# EAGLE design PiCycle PCB (EAGLE 8.7.0)
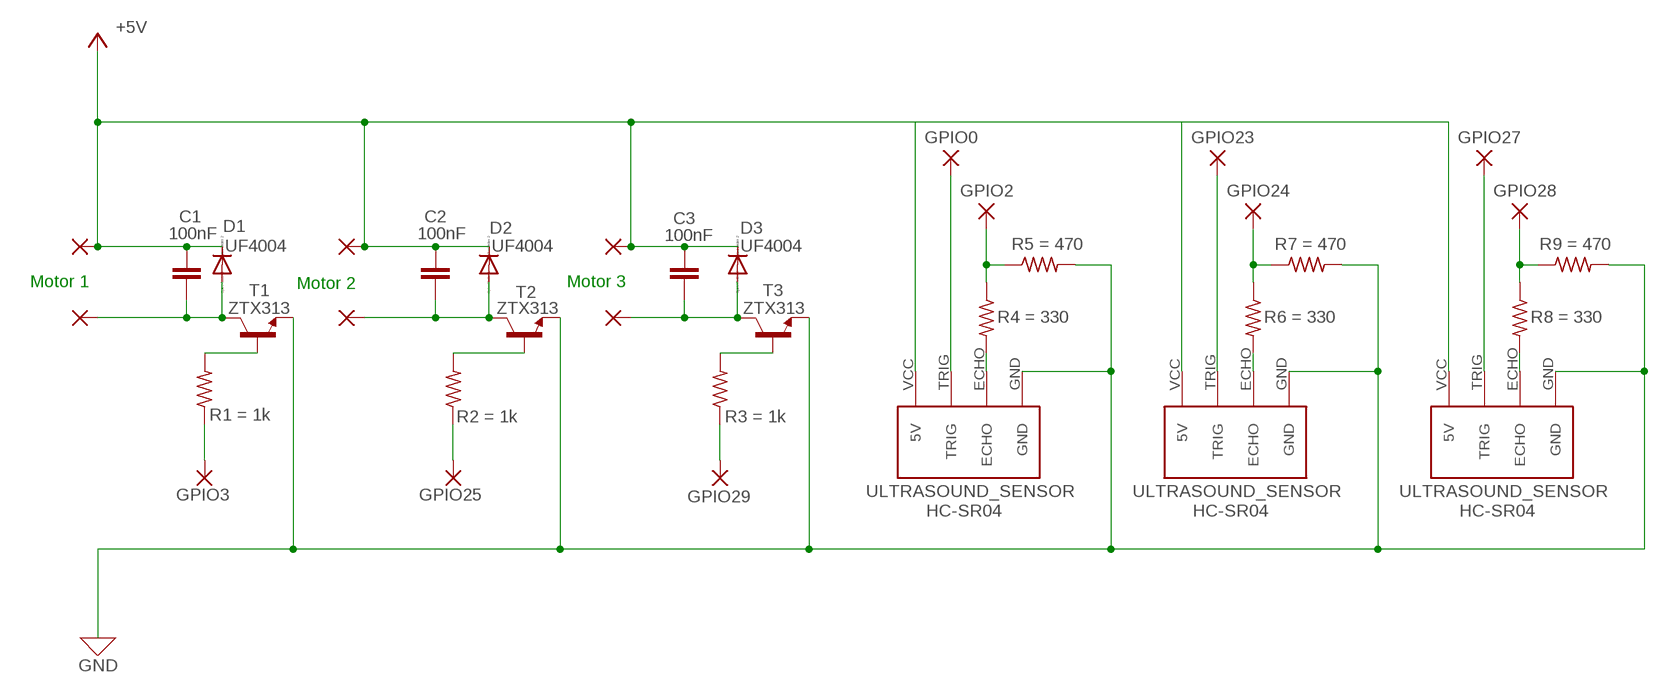
[diagram p0: schematic, sheet 1]

## Parts
C1  C15/6  [C15B6]
C2  C15/6  [C15B6]
C3  C15/6  [C15B6]
D1  BA243A  [DO35-10]
D2  BA243A  [DO35-10]
D3  BA243A  [DO35-10]
J_ULTRASONIC_1  HC-SR04  [HC-SR04_FOOTPRINT]
J_ULTRASONIC_2  HC-SR04  [HC-SR04_FOOTPRINT]
J_ULTRASONIC_3  HC-SR04  [HC-SR04_FOOTPRINT]
PAD1  3,81/1,4  [3,81/1,4]
PAD2  3,81/1,4  [3,81/1,4]
PAD3  3,81/1,4  [3,81/1,4]
PAD4  3,81/1,4  [3,81/1,4]
PAD5  3,81/1,4  [3,81/1,4]
PAD6  3,81/1,4  [3,81/1,4]
PAD7  3,81/1,4  [3,81/1,4]
PAD8  3,81/1,4  [3,81/1,4]
PAD9  3,81/1,4  [3,81/1,4]
PAD10  3,81/1,4  [3,81/1,4]
PAD11  3,81/1,4  [3,81/1,4]
PAD12  3,81/1,4  [3,81/1,4]
PAD13  3,81/1,4  [3,81/1,4]
PAD14  3,81/1,4  [3,81/1,4]
PAD15  3,81/1,4  [3,81/1,4]
R1  R-US_0207/15  [0207/15]
R2  R-US_0207/15  [0207/15]
R3  R-US_0207/15  [0207/15]
R4  R-US_0207/15  [0207/15]
R5  R-US_0207/15  [0207/15]
R6  R-US_0207/15  [0207/15]
R7  R-US_0207/15  [0207/15]
R8  R-US_0207/15  [0207/15]
R9  R-US_0207/15  [0207/15]
T1  2N706  [TO18]
T2  2N706  [TO18]
T3  2N706  [TO18]

## Nets
0: J_ULTRASONIC_1.GND J_ULTRASONIC_2.GND J_ULTRASONIC_3.GND R5.2 R7.2 R9.2 T1.1(E) T2.1(E) T3.1(E) ; supply symbol labelled GND
+5V: C1.1 C2.1 C3.1 D1.C D2.C D3.C J_ULTRASONIC_1.VCC(5V) PAD5.1(P) PAD6.1(P) PAD9.1(P)
+5V1: J_ULTRASONIC_2.VCC(5V)
+5V2: J_ULTRASONIC_3.VCC(5V)
N$1: PAD1.1(P) R1.1
N$2: PAD2.1(P) R2.1
N$3: PAD3.1(P) R3.1
N$4: R1.2 T1.2(B)
N$5: R2.2 T2.2(B)
N$6: R3.2 T3.2(B)
N$7: C1.2 D1.A PAD4.1(P) T1.3(C)
N$8: C2.2 D2.A PAD7.1(P) T2.3(C)
N$9: C3.2 D3.A PAD8.1(P) T3.3(C)
N$10: J_ULTRASONIC_2.TRIG PAD10.1(P)
N$11: J_ULTRASONIC_1.TRIG PAD11.1(P)
N$12: J_ULTRASONIC_2.ECHO R4.2
N$13: J_ULTRASONIC_1.ECHO R8.2
N$14: PAD15.1(P) R8.1 R9.1
N$15: PAD12.1(P) R4.1 R5.1
N$16: J_ULTRASONIC_3.TRIG PAD13.1(P)
N$17: J_ULTRASONIC_3.ECHO R6.2
N$18: PAD14.1(P) R6.1 R7.1

## Notes on the sheet
- Motor 1 | Motor 2 | Motor 3

## Library data of the parts
C1 = capacitor-wima:C: CAPACITOR naming: grid - package width; CAPPYU: 100nF
C2 C3 = capacitor-wima:C: CAPACITOR naming: grid - package width; CAPPY: 100nF
D1-D3 = diode:BA243A: DIODE
J_ULTRASONIC_1-J_ULTRASONIC_3 = Ultrasonic Sensor HC-SR04:HC-SR04: Ultrasonic Sensor HC-SR04
PAD1-PAD15 = wirepad:3,81/1,4: THROUGH-HOLE PAD
R1 = rcl:R-US_: RESISTOR, American symbol; R1: 1k; SPICEPREFIX: 1k
R2 = rcl:R-US_: RESISTOR, American symbol; R2: 1k; SPICEPREFIX: 1k
R3 = rcl:R-US_: RESISTOR, American symbol; R3: 1k; SPICEPREFIX: 1k
R4 = rcl:R-US_: RESISTOR, American symbol; R6: 330; SPICEPREFIX: 1k
R5 = rcl:R-US_: RESISTOR, American symbol; R7: 470; SPICEPREFIX: 1k
R6 = rcl:R-US_: RESISTOR, American symbol; R8: 330; SPICEPREFIX: 1k
R7 = rcl:R-US_: RESISTOR, American symbol; R9: 470; SPICEPREFIX: 1k
R8 = rcl:R-US_: RESISTOR, American symbol; R4: 330; SPICEPREFIX: 1k
R9 = rcl:R-US_: RESISTOR, American symbol; R5: 470; SPICEPREFIX: 1k
T1-T3 = transistor:2N706: NPN TRANSISTOR

## Board
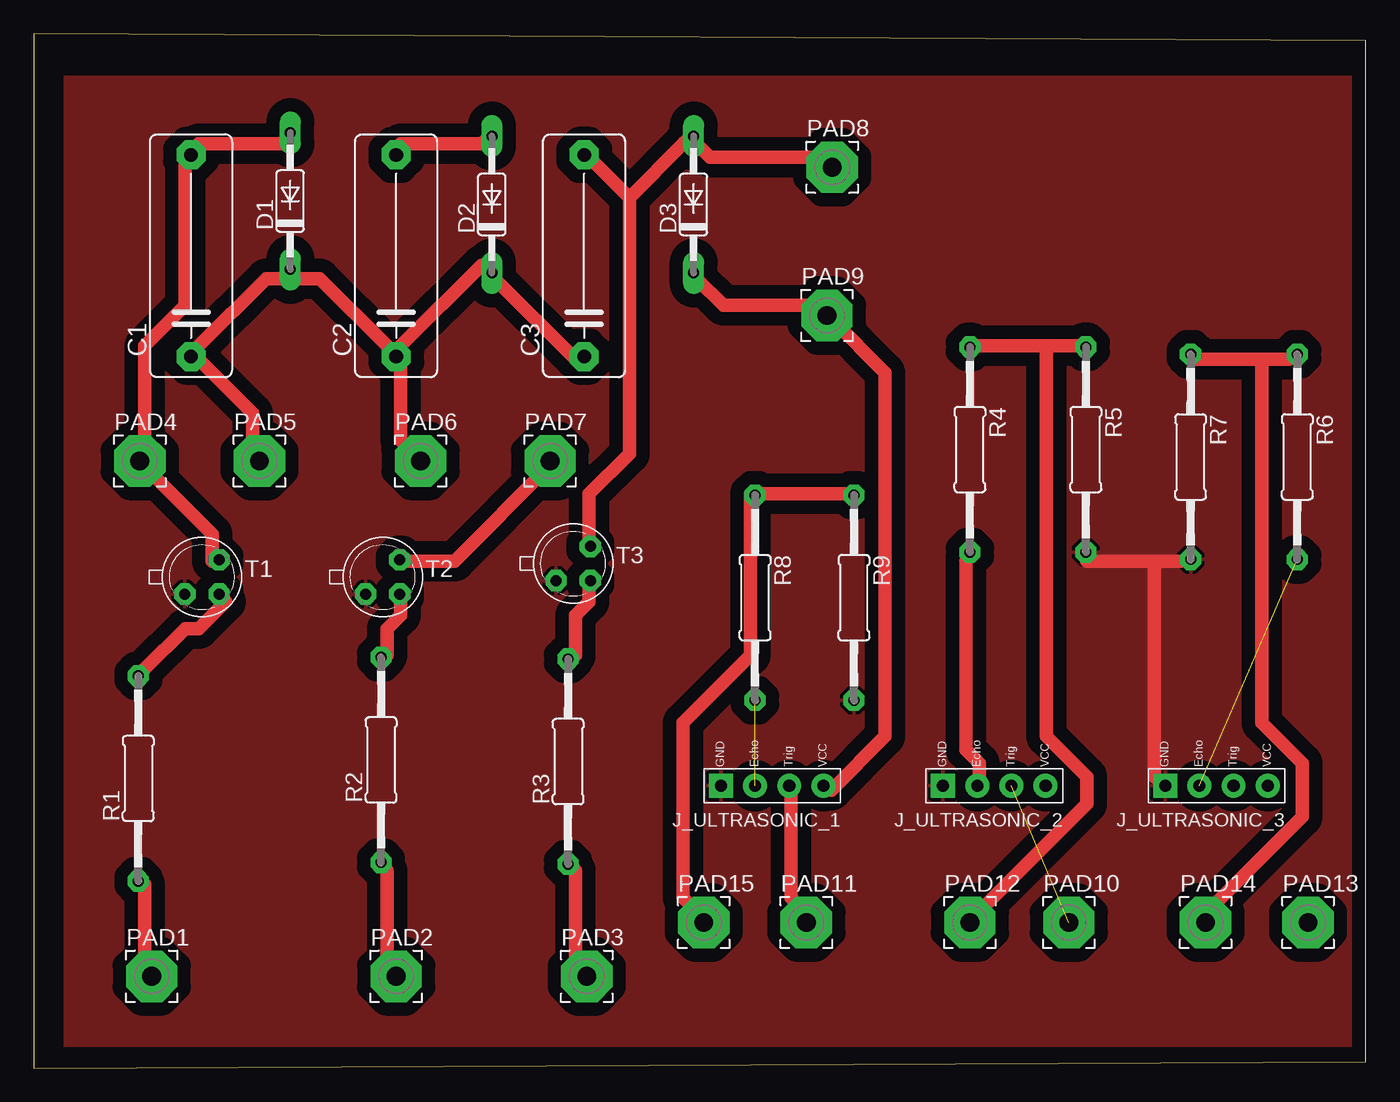
[diagram p1: board, top side]
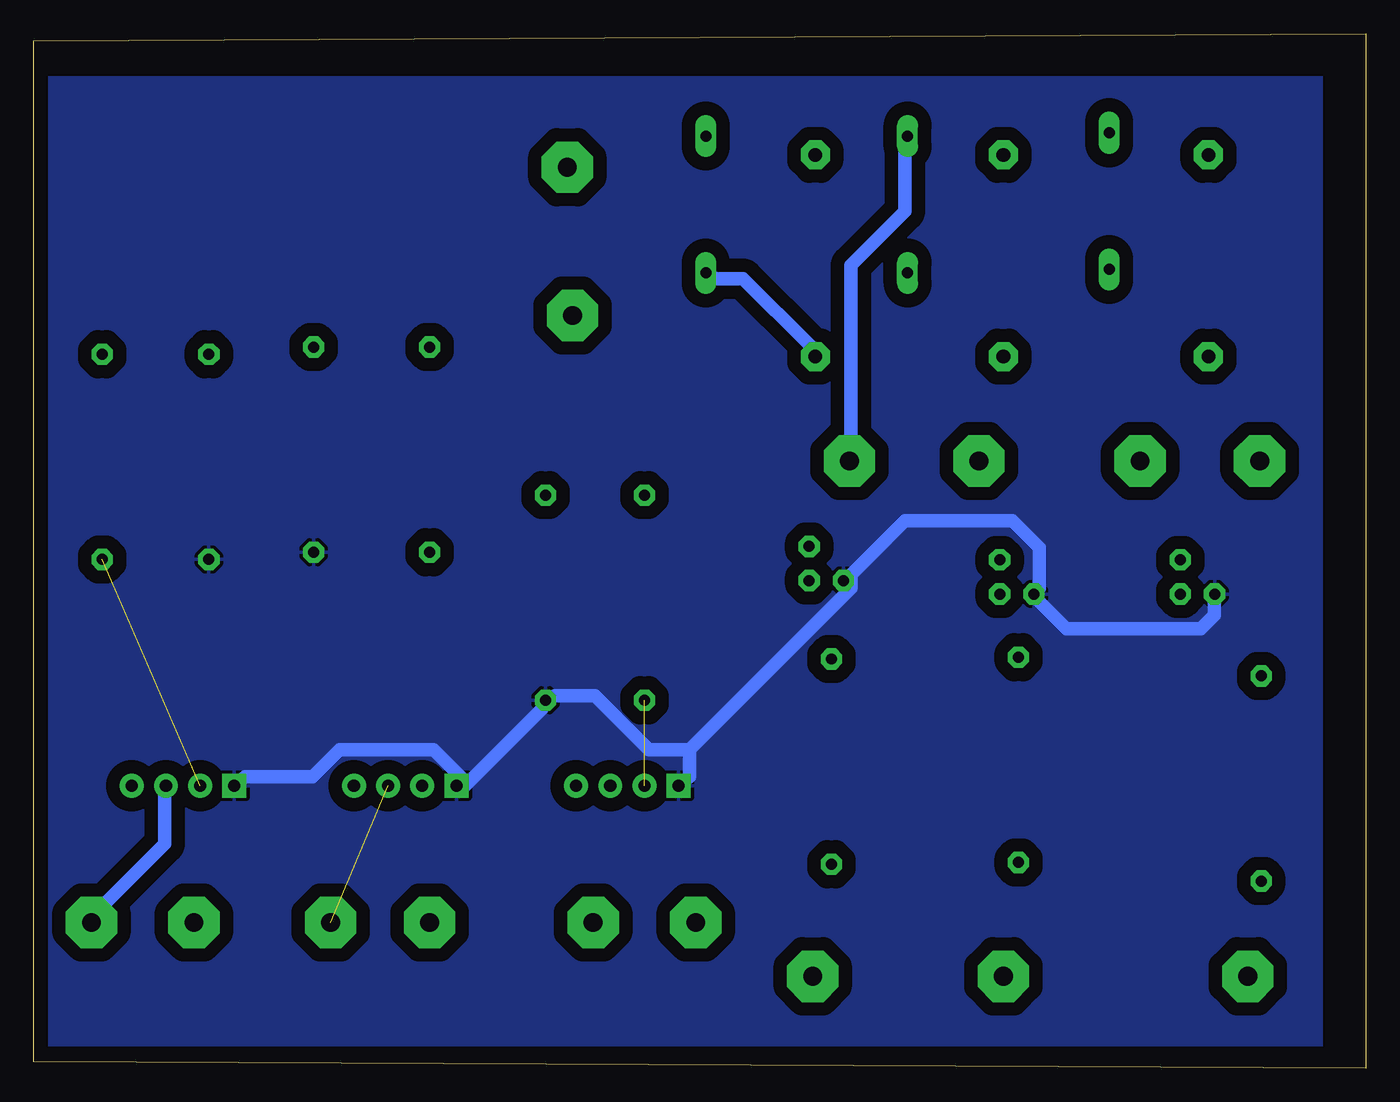
[diagram p2: board, bottom side, seen from below]

Size 99 x 76.84 mm. Coordinates in mm from the lower left corner, seen from the top.
Outline: 0,0 99,0.46 99,76.3 0,76.84 0,0
Copper layers (1*16): Top 0.035mm / dielectric 1.5mm / Bottom 0.035mm
Design rules "default *": minimum track width 1mm, minimum drill 30mil, track to track 1mm, track to pad 1mm, pad to pad 1mm, via to via 1mm, smd to smd 60mil, copper to edge 40mil, drill to drill 6mil, minimum pad ring 15mil, minimum via ring 15mil, stop-mask expansion 4mil, vias tented up to drill 0mil, thermal gap 10mil

### Footprints (pad centres in the part's own frame; a part is rotated, then mirrored left to right if it is on the bottom)
C15B6 = drill 1.016 pad 2.159 octagon: 1 -7.493,0; 2 7.493,0
DO35-10 = drill 0.813 long: A 5.08,0; C -5.08,0
HC-SR04_FOOTPRINT = drill 0.9 pad 1.778: ECHO 0,1.27; TRIG 0,-1.27; VCC 0,-3.81 | drill 0.9 pad 1.778 square: GND 0,3.81
3,81/1,4 = drill 1.397 pad 3.81 octagon: 1 0,0
0207/15 = drill 0.813 octagon: 1 -7.62,0; 2 7.62,0
TO18 = drill 0.813 octagon: 1 -1.27,-1.27; 2 1.27,-1.27; 3 1.27,1.27

### Placement (x,y rotation side)
C1  11.7,60.34 90 top
C2  26.94,60.34 90 top
C3  40.91,60.34 90 top
D1  19.07,64.4 90 top
D2  34.05,64.15 90 top
D3  49.04,64.15 90 top
J_ULTRASONIC_1  54.88,20.97 90 top
J_ULTRASONIC_2  71.39,20.97 90 top
J_ULTRASONIC_3  87.9,20.97 90 top
PAD1  8.78,6.81 0 top
PAD2  26.94,6.81 0 top
PAD3  41.1,6.81 0 top
PAD4  7.89,45.1 0 top
PAD5  16.78,45.1 0 top
PAD6  28.75,45.1 0 top
PAD7  38.37,45.1 0 top
PAD8  59.34,66.91 0 top
PAD9  58.96,55.91 0 top
PAD10  76.93,10.81 0 top
PAD11  57.42,10.81 0 top
PAD12  69.58,10.81 0 top
PAD13  94.71,10.81 0 top
PAD14  87.09,10.81 0 top
PAD15  49.8,10.81 0 top
R1  7.78,21.51 90 top
R2  25.81,22.89 90 top
R3  39.72,22.76 90 top
R4  69.58,45.94 270 top
R5  78.2,45.94 270 top
R6  93.9,45.4 270 top
R7  85.98,45.4 270 top
R8  53.61,34.94 270 top
R9  60.96,34.94 270 top
T1  12.51,36.48 0 top
T2  25.94,36.48 0 top
T3  40.1,37.48 0 top

### Tracks (layer width: path | path; a pad name or v marks a point on that pad's centre or on a via)
0
  Top 1: 83.27,37.65 78.27,37.65 R5.2 | 83.27,37.65 85.27,37.65 R7.2 | 83.27,37.65 83.27,21.65 J_ULTRASONIC_3.GND
  Bottom 1: T1.1 11.27,34.65 11.27,33.65 12.27,32.65 22.27,32.65 24.27,34.65 T2.1 24.27,35.65 24.27,38.65 26.27,40.65 34.27,40.65 38.27,36.65 | 38.27,36.65 38.27,35.65 50.27,23.65 | 50.27,23.65 50.27,21.65 J_ULTRASONIC_1.GND | 50.27,23.65 53.27,23.65 57.27,27.65 60.27,27.65 R9.2 61.27,26.65 67.27,20.65 J_ULTRASONIC_2.GND 67.27,21.65 69.27,23.65 76.27,23.65 78.27,21.65 83.27,21.65 J_ULTRASONIC_3.GND | 38.27,36.65 T3.1
  pour Bottom: 3.27,73.65 3.27,1.65 98.27,1.65 98.27,73.65
  pour Top: 2.27,72.65 2.27,1.65 98.27,1.65 98.27,73.65 2.27,73.65
+5V
  Top 1: J_ULTRASONIC_1.VCC 59.27,20.65 63.27,24.65 63.27,51.65 59.27,55.65 PAD9.1 58.27,56.65 51.27,56.65 49.27,58.65 D3.C | 19.27,58.65 17.27,58.65 12.27,53.65 C1.1 12.27,52.65 16.27,48.65 16.27,45.65 PAD5.1 | C2.1 27.27,52.65 27.27,46.65 28.27,45.65 PAD6.1 | C3.1 40.27,52.65 34.27,58.65 D2.C 33.27,59.65 27.27,53.65 C2.1 | 19.27,58.65 21.27,58.65 26.27,53.65 C2.1 | 19.27,58.65 D1.C
  Bottom 1: D3.C 48.27,58.65 46.27,58.65 41.27,53.65 C3.1
N$1
  Top 1: R1.1 8.27,13.65 8.27,7.65 PAD1.1
N$2
  Top 1: R2.1 26.27,14.65 26.27,7.65 PAD2.1
N$3
  Top 1: R3.1 40.27,14.65 40.27,7.65 PAD3.1
N$4
  Top 1: R1.2 8.27,29.65 11.27,32.65 12.27,32.65 14.27,34.65 T1.2
N$5
  Top 1: R2.2 26.27,30.65 26.27,32.65 27.27,33.65 27.27,34.65 T2.2
N$6
  Top 1: R3.2 40.27,30.65 40.27,33.65 41.27,34.65 41.27,35.65 T3.2
N$7
  Top 1: D1.A 19.27,68.65 12.27,68.65 C1.2 11.27,67.65 11.27,56.65 8.27,53.65 8.27,45.65 PAD4.1 8.27,44.65 13.27,39.65 13.27,37.65 T1.3
N$8
  Top 1: D2.A 33.27,68.65 27.27,68.65 C2.2 | T2.3 27.27,37.65 31.27,37.65 38.27,44.65 PAD7.1
  Bottom 1: D2.A 34.27,68.65 34.27,63.65 38.27,59.65 38.27,45.65 PAD7.1
N$9
  Top 1: 44.27,64.65 44.27,45.65 41.27,42.65 41.27,38.65 T3.3 | 44.27,64.65 41.27,67.65 C3.2 | 44.27,64.65 48.27,68.65 D3.A 49.27,68.65 50.27,67.65 59.27,67.65 PAD8.1
N$10  (1 unrouted)
N$11
  Top 1: J_ULTRASONIC_1.TRIG 56.27,20.65 56.27,12.65 57.27,11.65 PAD11.1
N$12
  Top 1: R4.2 69.27,37.65 69.27,23.65 70.27,22.65 70.27,21.65 J_ULTRASONIC_2.ECHO
N$13  (1 unrouted)
N$14
  Top 1: R9.1 60.27,42.65 54.27,42.65 R8.1 53.27,42.65 53.27,30.65 48.27,25.65 48.27,12.65 49.27,11.65 PAD15.1
N$15
  Top 1: 75.27,53.65 78.27,53.65 R5.1 | 75.27,53.65 70.27,53.65 R4.1 | 75.27,53.65 75.27,24.65 78.27,21.65 78.27,19.65 70.27,11.65 PAD12.1
N$16
  Bottom 1: J_ULTRASONIC_3.TRIG 89.27,20.65 89.27,16.65 94.27,11.65 PAD13.1
N$17  (1 unrouted)
N$18
  Top 1: 91.27,52.65 93.27,52.65 R6.1 | 91.27,52.65 86.27,52.65 R7.1 | 91.27,52.65 91.27,25.65 94.27,22.65 94.27,18.65 87.27,11.65 PAD14.1